# Altium project MIXR Input and Processing.PrjPcb (part 4 of 6)

## Sheet MIXR Input - Instrument Inputs.SchDoc: Instrument Inputs
size B; Organization: Midnight Sun Solar Rayce Car Team; Address1: University of Waterloo; Address2: 200 University Ave W; Address3: Waterloo, ON, Canada; Address4: N2L 3E9; DocumentNumber: 4; SheetNumber: 4; SheetTotal: 15; Website: www.uwmidsun.com; ProjectName: ProjectName
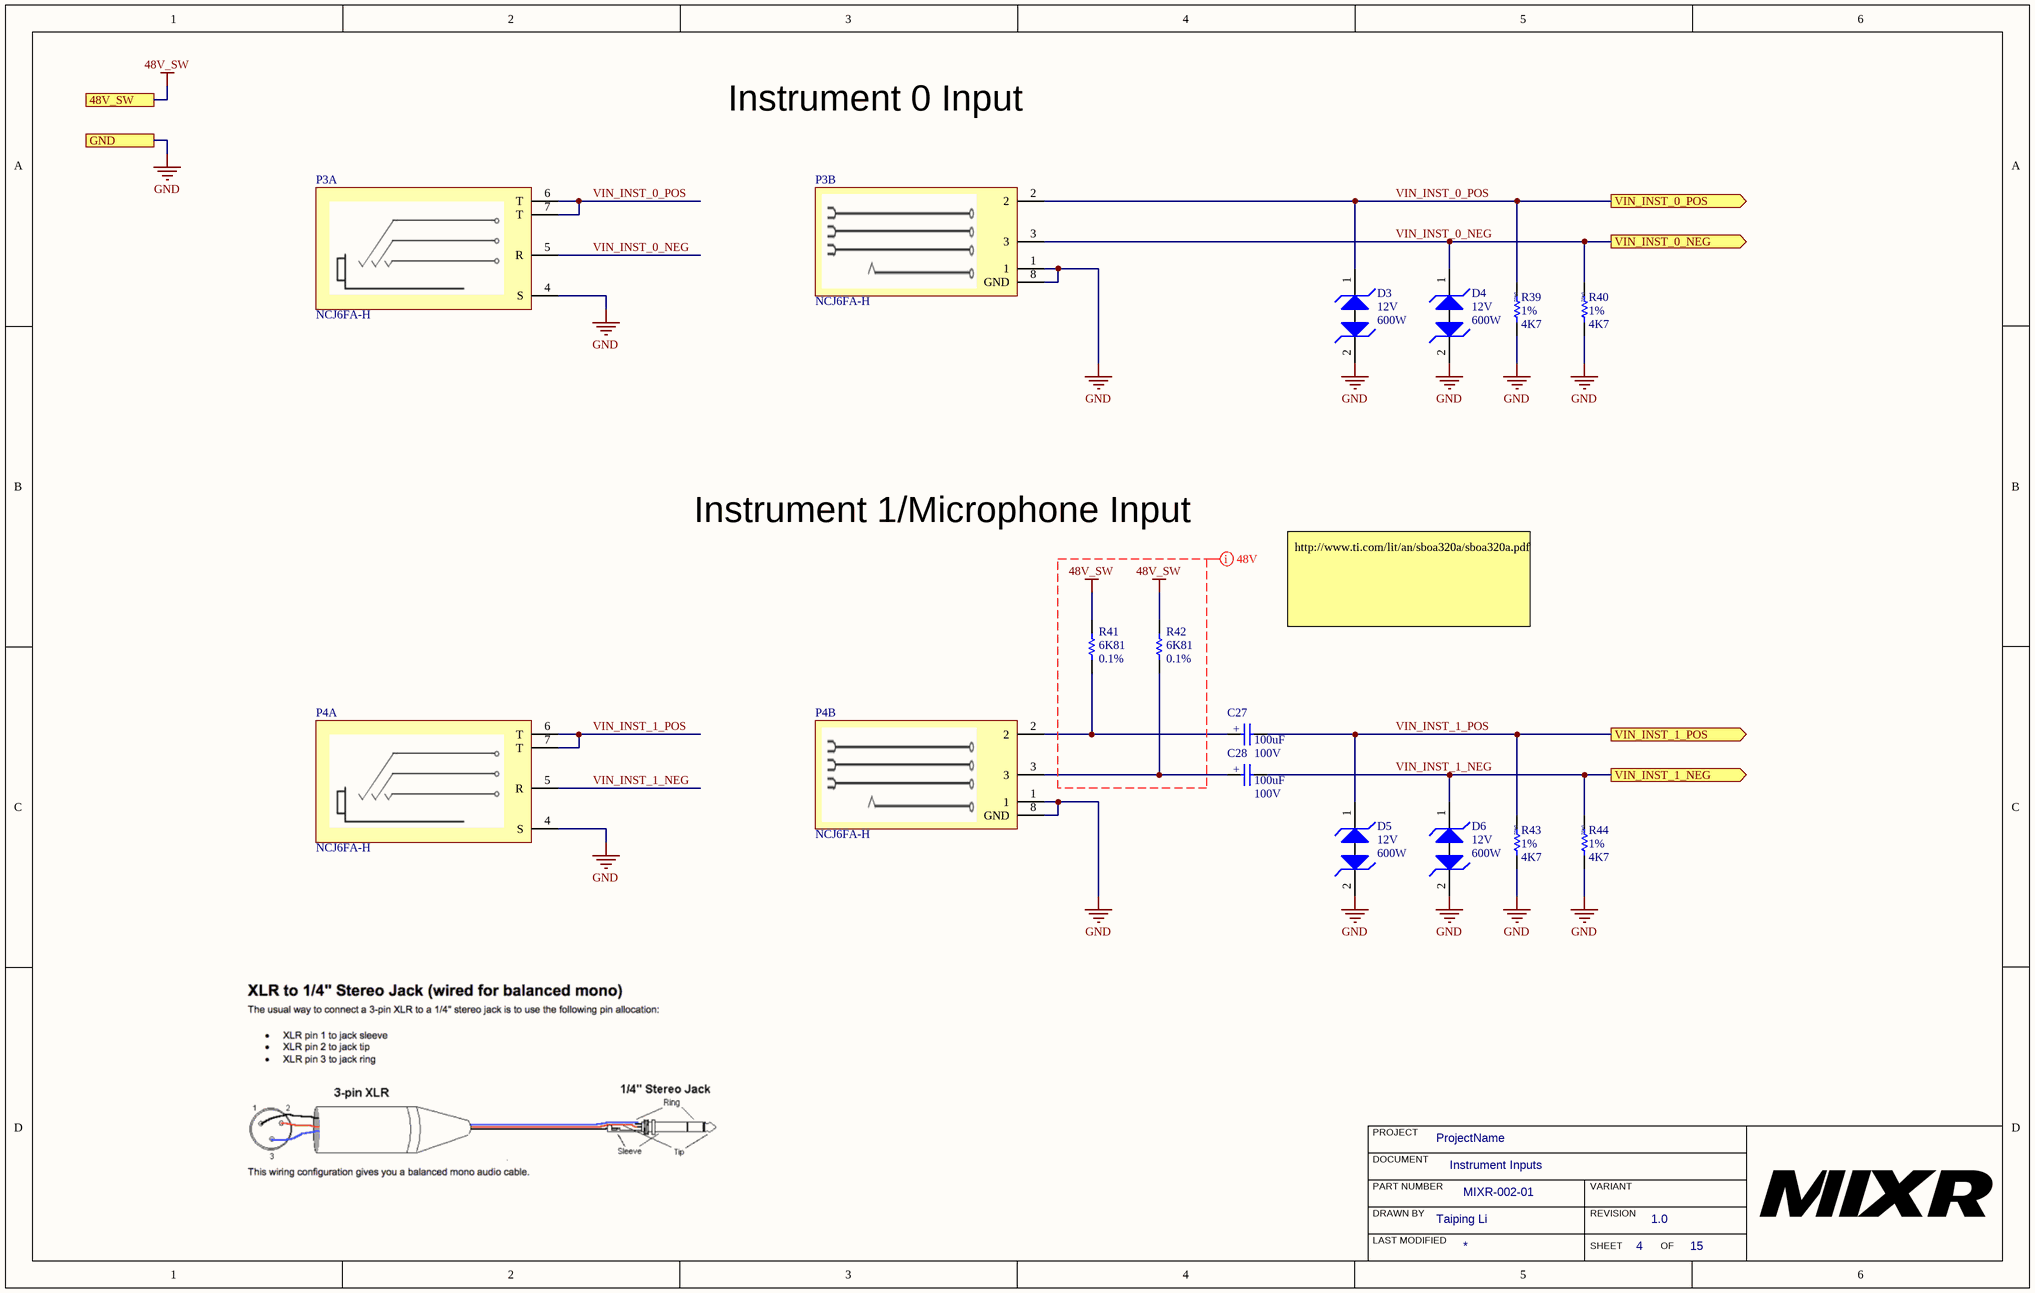
[diagram p7: MIXR Input - Instrument Inputs.SchDoc]

### Parts
C27  Capacitance: 100uF  Voltage Rating: 100V  [CAP ALUM RADIAL 10x20]  (hidden comment: CAP ALUM 100UF 20% 100V RADIAL)
C28  Capacitance: 100uF  Voltage Rating: 100V  [CAP ALUM RADIAL 10x20]  (hidden comment: CAP ALUM 100UF 20% 100V RADIAL)
D3  Voltage - Reverse Standoff (Typ): 12V  Power - Peak Pulse: 600W  [DO-214AA Diode - BI]  (hidden comment: DIODE TVS 12VWM 19.6VC DO-214AA (SMB))
D4  Voltage - Reverse Standoff (Typ): 12V  Power - Peak Pulse: 600W  [DO-214AA Diode - BI]  (hidden comment: DIODE TVS 12VWM 19.6VC DO-214AA (SMB))
D5  Voltage - Reverse Standoff (Typ): 12V  Power - Peak Pulse: 600W  [DO-214AA Diode - BI]  (hidden comment: DIODE TVS 12VWM 19.6VC DO-214AA (SMB))
D6  Voltage - Reverse Standoff (Typ): 12V  Power - Peak Pulse: 600W  [DO-214AA Diode - BI]  (hidden comment: DIODE TVS 12VWM 19.6VC DO-214AA (SMB))
P3  Manufacturer Part Number: NCJ6FA-H  [CONN XLR-TRS COMBO 3 POLE]  (hidden comment: CONN XLR-TRS COMBO 3 POLE)  (parts A,B of 2)
P4  Manufacturer Part Number: NCJ6FA-H  [CONN XLR-TRS COMBO 3 POLE]  (hidden comment: CONN XLR-TRS COMBO 3 POLE)  (parts A,B of 2)
R39  Tolerance: 1%  Resistance: 4K7  [RES 0402]  (hidden comment: RES 4.7K OHM 1% 1/10W 0402)
R40  Tolerance: 1%  Resistance: 4K7  [RES 0402]  (hidden comment: RES 4.7K OHM 1% 1/10W 0402)
R41  Tolerance: 0.1%  Resistance: 6K81  [RES, 0603]  (hidden comment: RES 6.81k OHM 0.1% 1/10W 0603)
R42  Tolerance: 0.1%  Resistance: 6K81  [RES, 0603]  (hidden comment: RES 6.81k OHM 0.1% 1/10W 0603)
R43  Tolerance: 1%  Resistance: 4K7  [RES 0402]  (hidden comment: RES 4.7K OHM 1% 1/10W 0402)
R44  Tolerance: 1%  Resistance: 4K7  [RES 0402]  (hidden comment: RES 4.7K OHM 1% 1/10W 0402)

### Ports
48V_SW, GND, VIN_INST_0_NEG (out), VIN_INST_0_POS (out), VIN_INST_1_NEG (out), VIN_INST_1_POS (out)

### Nets
48V_SW: R41.1 R42.1 ; port 48V_SW
GND: D3.2(Cathode2) D4.2(Cathode2) D5.2(Cathode2) D6.2(Cathode2) P3.1 P3.4(S) P3.8(GND) P4.1 P4.4(S) P4.8(GND) R39.2 R40.2 R43.2 R44.2 ; port GND
VIN_INST_0_NEG: D4.1(Cathode1) P3.3 P3.5(R) R40.1 ; port VIN_INST_0_NEG
VIN_INST_0_POS: D3.1(Cathode1) P3.2 P3.6(T) P3.7(T) R39.1 ; port VIN_INST_0_POS
VIN_INST_1_NEG: C28.2 D6.1(Cathode1) P4.5(R) R44.1 ; port VIN_INST_1_NEG
VIN_INST_1_POS: C27.2 D5.1(Cathode1) P4.6(T) P4.7(T) R43.1 ; port VIN_INST_1_POS
NetC27_1: C27.1 P4.2 R41.2
NetC28_1: C28.1 P4.3 R42.2

### Layout directives
mark named 48V: 48V_SW

### Notes on the sheet
- Instrument 0 Input
- Instrument 1/Microphone Input
- http://www.ti.com/lit/an/sboa320a/sboa320a.pdf
- PROJECT
- DOCUMENT
- DRAWN BY
- LAST MODIFIED
- PART NUMBER
- REVISION
- SHEET
- VARIANT
- OF
- (in symbol CAP ALUM 100UF 20% 100V RADIAL) +

### Library data of the parts
C27 C28 = CAP ALUM 100UF 20% 100V RADIAL: Manufacturer: Nichicon; Manufacturer Part Number: UFW2A101MPD1TD; Ripple Current: 350mA; Life (Hours): 2000Hour; Supplier 1: Digi-Key; RoHS: Yes; Stock 1: 465; Pricing 1: 1=0.72000, 10=0.53000, 100=0.36360 (USD); Supplier Part Number 1: 493-11050-1-ND; Category: Aluminum Electrolytic Capacitors; Mount: Through Hole; Case/Package: Radial; Min Operating Temperature: -40°C; Max Operating Temperature: 85°C; Package Quantity: 500; Packaging: Tape and Reel; Tolerance: 20%; Lead Pitch: 0.197inch; Height - Seated (Max): 0.866inch; ComponentLink1URL: https://datasheet.ciiva.com/29547/e-fw-29547515.pdf?src-supplier=Digi-Key; ComponentLink1Description: https://datasheet.ciiva.com/29547/e-fw-29547515.pdf?src-supplier=Digi-Key; ComponentLink2URL: https://datasheet.ciiva.com/29547/e-fw-29547516.pdf?src-supplier=Digi-Key; ComponentLink2Description: https://datasheet.ciiva.com/29547/e-fw-29547516.pdf?src-supplier=Digi-Key
D3-D6 = DIODE TVS 12VWM 19.6VC DO-214AA (SMB): TVS DIODE 12V 19.6V DO214AA; Manufacturer: Vishay Semiconductor Diodes Division; Manufacturer Part Number: SMBJ12CD-M3/H; Type: Zener; Voltage - Breakdown (Min): 13.5V; Current - Peak Pulse (10/1000µs): 30.6A; Power Line Protection: No; Supplier 1: Digi-Key; RoHS: RoHS Compliant; Category: Circuit Protection; Stock 1: 4469; Pricing 1: 1=0.69, 10=0.565, 25=0.516, 100=0.3841, 250=0.34808 (CAD); Packaging: Cut Tape (CT); Part Status: Active; Voltage - Clamping (Max) @ Ipp: 19.6V; Applications: General Purpose; Capacitance @ Frequency: -; Operating Temperature: -55°C ~ 150°C (TJ); Mounting Type: Surface Mount; Package / Case: DO-214AA, SMB; Supplier Device Package: DO-214AA (SMBJ); ComponentLink1URL: http://www.vishay.com/docs/87606/87606.pdf; ComponentLink1Description: http://www.vishay.com/docs/87606/87606.pdf; Supplier Part Number 1: SMBJ12CD-M3/HGICT-ND
P3 P4 = CONN XLR-TRS COMBO 3 POLE: XLR Connectors A SERIES COMBO;3POLE FEM;PCB HOR; Manufacturer_Name: Neutrik; Body Material: Metal; Gender: Female; Current Rating: 3A; Voltage Rating: 50V; Number of Positions: 3; Number of Ports: 1; Number of Contacts: 6; Connector Type: Socket; Datasheet Link: http://www.neutrik.com/zoolu-website/media/download/13540/Product+Guide+-+Section+XLR; Manufacturer_Part_Number: NCJ6FA-H; Mouser Part Number: 568-NCJ6FA-H; Mouser Price/Stock: https://www.mouser.com/Search/Refine.aspx?Keyword=568-NCJ6FA-H; Supplier 1: Mouser; Supplier Part Number 1: 568-NCJ6FA-H; Manufacturer: Neutrik; Stock 1: 3848; Pricing 1: 1 = 2.06000, 10 = 1.96000, 50 = 1.86000, 100 = 1.80000, 1000 = 1.77000, 10000 = 1.77000 (USD); RoHS: Yes; Case/Package: Metal; Number of Pins: 3; Weight: 0.388014oz; Contact Material: Bronze; Contact Plating: Gold; Number of Terminals: 6; Housing Material: Polyamide; Color: Black; Min Operating Temperature: -30°C; Max Operating Temperature: 80°C; Package Quantity: 10; Termination: Solder; Orientation: Horizontal; Length: 25mm; Depth: 30.2mm; REACH SVHC: No SVHC; Flammability Rating: UL94 HB; ComponentLink1URL: https://datasheet.ciiva.com/30126/neutrik-ncj6fa-h-1-30126129.pdf?src-supplier=Onlinecomponents.com; ComponentLink1Description: https://datasheet.ciiva.com/30126/neutrik-ncj6fa-h-1-30126129.pdf?src-supplier=Onlinecomponents.com; ComponentLink2URL: https://datasheet.ciiva.com/8008/76755-8008003.pdf?src-supplier=Element14; ComponentLink2Description: https://datasheet.ciiva.com/8008/76755-8008003.pdf?src-supplier=Element14; ComponentLink3URL: https://datasheet.ciiva.com/24394/neutrik-ncj6fa-h-1-24394955.pdf?src-supplier=Onlinecomponents.com; ComponentLink3Description: https://datasheet.ciiva.com/24394/neutrik-ncj6fa-h-1-24394955.pdf?src-supplier=Onlinecomponents.com
R39 R40 R43 R44 = RES 4.7K OHM 1% 1/10W 0402: YAGEO (PHYCOMP) - RC0402FR-074K7L - RES, THICK FILM, 4K7, 1%, 0.063W, 0402; Voltage Rating (DC): 50V; Power Rating: 62.5mW; Temperature Coefficient: 100ppm/°C; Supplier 1: Digi-Key; Manufacturer: Yageo; Manufacturer Part Number: RC0402FR-074K7L; RoHS: Yes; Category: Chip SMD Resistors; Stock 1: 11223879; Pricing 1: 1=0.10000, 10=0.01600, 100=0.00640, 1000=0.00289, 2500=0.00251, 5000=0.00207 (USD); Case/Package: 0402; Number of Pins: 2; Case Code (Imperial): 0402; Case Code (Metric): 1005; Min Operating Temperature: -55°C; Max Operating Temperature: 155°C; Voltage Rating: 50V; Packaging: Tape and Reel; Composition: Thick Film; Termination: SMD/SMT; Military Standard: Not; Length: 1mm; Height: 0.32mm; Width: 0.5mm; Depth: 0.5mm; REACH SVHC: No SVHC; Lead Free: Lead Free; ComponentLink1URL: https://datasheet.ciiva.com/7850/1018594-7850022.pdf?src-supplier=Element14; ComponentLink1Description: https://datasheet.ciiva.com/7850/1018594-7850022.pdf?src-supplier=Element14; ComponentLink2URL: https://datasheet.ciiva.com/7850/1018594-7850023.pdf?src-supplier=Element14; ComponentLink2Description: https://datasheet.ciiva.com/7850/1018594-7850023.pdf?src-supplier=Element14; ComponentLink3URL: https://datasheet.ciiva.com/15215/getdatasheetpartid-328119-15215035.pdf?src-supplier=Verical; ComponentLink3Description: https://datasheet.ciiva.com/15215/getdatasheetpartid-328119-15215035.pdf?src-supplier=Verical; ComponentLink4URL: https://datasheet.ciiva.com/22661/1686128-22661342.pdf?src-supplier=Element14; ComponentLink4Description: https://datasheet.ciiva.com/22661/1686128-22661342.pdf?src-supplier=Element14; Supplier Part Number 1: 311-4.7KLRCT-ND
R41 R42 = RES 6.81k OHM 0.1% 1/10W 0603: RES SMD 6.81K OHM 0.1% 1/5W 0603; Manufacturer: Panasonic; Manufacturer Part Number: ERJ-PB3B6811V; Max Power Dissipation: 200mW; Temperature Coefficient: 50ppm/°C; ComponentLink1URL: https://www.seielect.com/Catalog/SEI-RMCF_RMCP.pdf; ComponentLink1Description: https://www.seielect.com/Catalog/SEI-RMCF_RMCP.pdf; Supplier 1: Digi-Key; RoHS: Yes; Category: Chip SMD Resistors; Stock 1: 4623; Pricing 1: 1=0.25000, 10=0.21100, 25=0.15320, 50=0.11100, 100=0.08230, 250=0.06316, 500=0.04976, 1000=0.03445 (USD); Case/Package: 0603; Case Code (Metric): 1608; Case Code (Imperial): 0603; Min Operating Temperature: -55°C; Max Operating Temperature: 155°C; Packaging: Tape and Reel; Composition: Thick Film; Number of Terminations: 2; Features: Automotive AEC-Q200; Length: 0.063inch; Width: 0.032inch; Height - Seated (Max): 0.022inch; ComponentLink2URL: https://industrial.panasonic.com/sa/system/files/data/download/catalog/id_fixed-resistors_e_2.pdf?src-supplier=Digi-Key; ComponentLink2Description: https://industrial.panasonic.com/sa/system/files/data/download/catalog/id_fixed-resistors_e_2.pdf?src-supplier=Digi-Key; Supplier Part Number 1: P20068CT-ND

## Sheet MIXR Input - Instrument 1 Filtering & ADC.SchDoc: Instrument 1/Microphone Filtering & ADC
size B; Organization: Midnight Sun Solar Rayce Car Team; Address1: University of Waterloo; Address2: 200 University Ave W; Address3: Waterloo, ON, Canada; Address4: N2L 3E9; DocumentNumber: 6; SheetNumber: 6; SheetTotal: 15; Website: www.uwmidsun.com; ProjectName: ProjectName
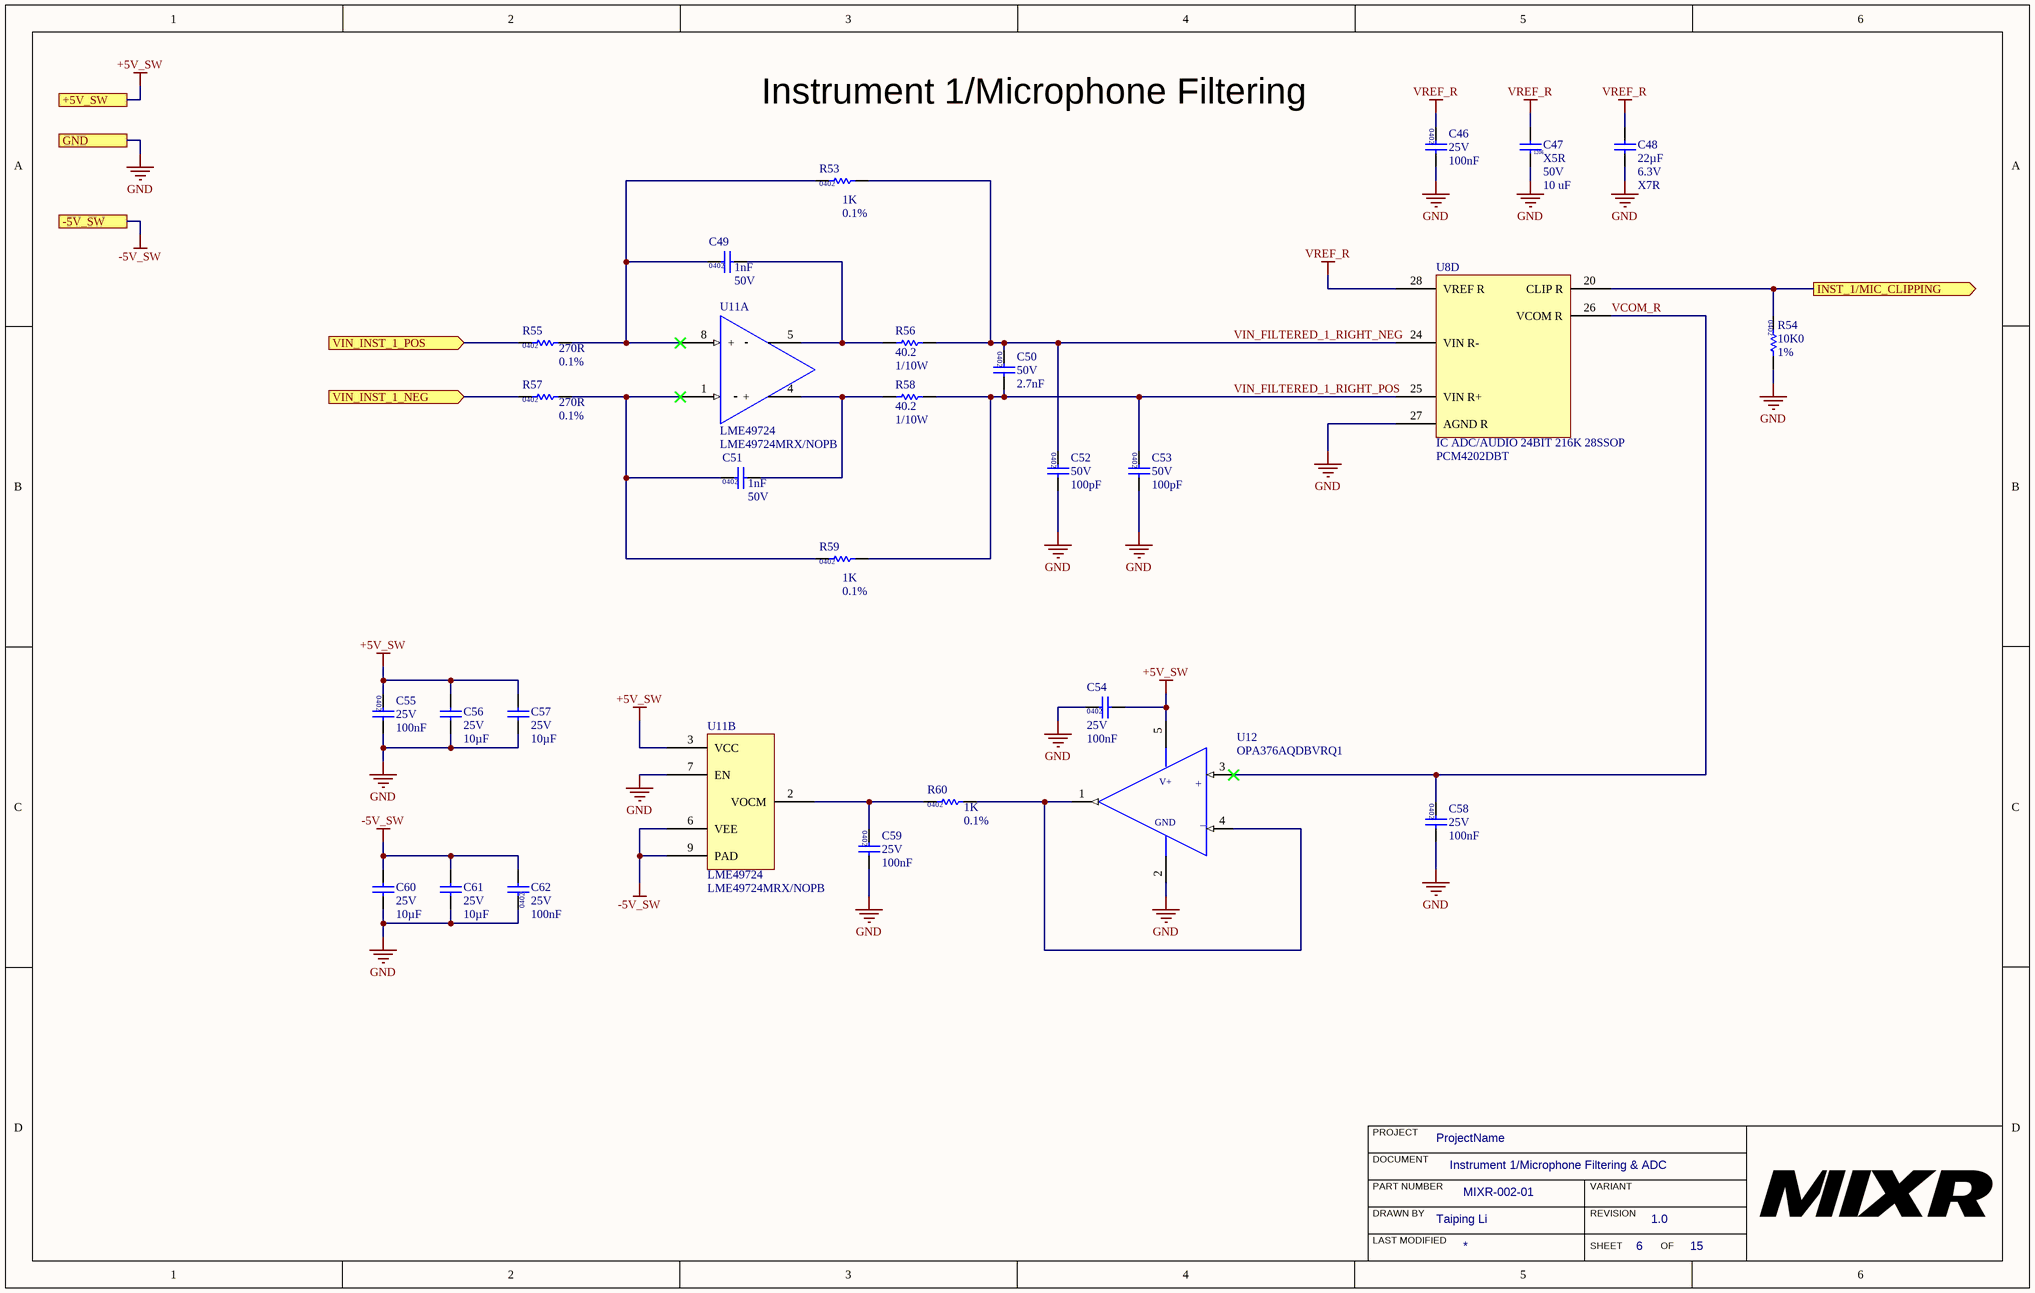
[diagram p8: MIXR Input - Instrument 1 Filtering & ADC.SchDoc]

### Parts
C46  Voltage: 25V  Capacitance: 100nF  [CAP 0402]  (hidden comment: CAP CER 0.1UF 16V X7R 0402)
C47  Rating: X5R  Voltage Rating: 50V  Capacitance: 10 uF  [CAP, 1206]  (hidden comment: CAP CER 10uF 50V 20% X5R 1206)
C48  Capacitance: 22µF  Voltage: 6.3V  Temperature Coefficient: X7R  [CAP, 1206]  (hidden comment: CAP CER 22UF 6.3V ±10% X7R 1206)
C49  Voltage Rating: 50V  Capacitance: 1nF  [CAP 0402]  (hidden comment: CAP CER 1nF 50V C0G 0402)
C50  Voltage Rating: 50V  Capacitance: 2.7nF  [CAP 0402]  (hidden comment: CAP CER 2700PF 50V X7R 0402)
C51  Voltage Rating: 50V  Capacitance: 1nF  [CAP 0402]  (hidden comment: CAP CER 1nF 50V C0G 0402)
C52  Voltage Rating: 50V  Capacitance: 100pF  [CAP 0402]  (hidden comment: CAP CER 100PF 50V C0G/NP0 0402)
C53  Voltage Rating: 50V  Capacitance: 100pF  [CAP 0402]  (hidden comment: CAP CER 100PF 50V C0G/NP0 0402)
C54  Voltage: 25V  Capacitance: 100nF  [CAP 0402]  (hidden comment: CAP CER 0.1UF 16V X7R 0402)
C55  Voltage: 25V  Capacitance: 100nF  [CAP 0402]  (hidden comment: CAP CER 0.1UF 16V X7R 0402)
C56  Voltage - Rated: 25V  Capacitance: 10µF  [CAP, 0805]  (hidden comment: CAP CER 10uF 25V 10% X5R 0805)
C57  Voltage - Rated: 25V  Capacitance: 10µF  [CAP, 0805]  (hidden comment: CAP CER 10uF 25V 10% X5R 0805)
C58  Voltage: 25V  Capacitance: 100nF  [CAP 0402]  (hidden comment: CAP CER 0.1UF 16V X7R 0402)
C59  Voltage: 25V  Capacitance: 100nF  [CAP 0402]  (hidden comment: CAP CER 0.1UF 16V X7R 0402)
C60  Voltage - Rated: 25V  Capacitance: 10µF  [CAP, 0805]  (hidden comment: CAP CER 10uF 25V 10% X5R 0805)
C61  Voltage - Rated: 25V  Capacitance: 10µF  [CAP, 0805]  (hidden comment: CAP CER 10uF 25V 10% X5R 0805)
C62  Voltage: 25V  Capacitance: 100nF  [CAP 0402]  (hidden comment: CAP CER 0.1UF 16V X7R 0402)
R53  Tolerance: 0.1%  Resistance: 1K  [RES 0402]  (hidden comment: RES 1K OHM 0.1% 1/16W 0402)
R54  Resistance: 10K0  Tolerance: 1%  [RES 0402]  (hidden comment: RES 10K OHM 1% 1/16W 0402)
R55  Tolerance: 0.1%  Resistance: 270R  [RES 0402]  (hidden comment: RES 270 OHM 0.1% 1/16W 0402)
R56  Resistance: 40.2  Power: 1/10W  [RES, 0603]  (hidden comment: RES 40.2 OHM 0.5% 1/10W 0603)
R57  Tolerance: 0.1%  Resistance: 270R  [RES 0402]  (hidden comment: RES 270 OHM 0.1% 1/16W 0402)
R58  Resistance: 40.2  Power: 1/10W  [RES, 0603]  (hidden comment: RES 40.2 OHM 0.5% 1/10W 0603)
R59  Tolerance: 0.1%  Resistance: 1K  [RES 0402]  (hidden comment: RES 1K OHM 0.1% 1/16W 0402)
R60  Tolerance: 0.1%  Resistance: 1K  [RES 0402]  (hidden comment: RES 1K OHM 0.1% 1/16W 0402)
U8  IC ADC/AUDIO 24BIT 216K 28SSOP  Manufacturer Part Number: PCM4202DBT  [IC ADC 24 BIT AUDIO 216 KHZ SSOP-28]  (part D of 4)
U11  LME49724  Manufacturer Part Number: LME49724MRX/NOPB  [IC OP AMP AUDIO LME49724 8-SOIC]  (parts A,B of 2)
U12  Manufacturer Part Number: OPA376AQDBVRQ1  [IC OP AMP GP RR 10MHZ SOT-23-5]  (hidden comment: IC OP AMP GEN PURPOSE RR 5.5MHZ SOT-23-5)

### Ports
+5V_SW, -5V_SW, GND, INST_1/MIC_CLIPPING (out), VIN_INST_1_NEG (in), VIN_INST_1_POS (in)

### Nets
+5V_SW: C54.2 C55.1 C56.1 C57.1 U11.3(VCC) U12.5(VDD) ; port +5V_SW
-5V_SW: C60.2 C61.2 C62.2 U11.6(VEE) U11.9(PAD) ; port -5V_SW
GND: C46.2 C47.2 C48.2 C52.2 C53.2 C54.1 C55.2 C56.2 C57.2 C58.2 C59.2 C60.1 C61.1 C62.1 R54.2 U8.27(AGND_R) U11.7(EN) U12.2(VSS) ; port GND
VREF_R: C46.1 C47.1 C48.1 U8.28(VREF_R)
INST_1/MIC_CLIPPING: R54.1 U8.20(CLIP_R) ; port INST_1/MIC_CLIPPING
VCOM_R: C58.1 U8.26(VCOM_R) U12.3(+IN)
VIN_FILTERED_1_RIGHT_NEG: C50.1 C52.1 R53.2 R56.2 U8.24(VIN_R-)
VIN_FILTERED_1_RIGHT_POS: C50.2 C53.1 R58.2 R59.2 U8.25(VIN_R+)
VIN_INST_1_NEG: R57.1 ; port VIN_INST_1_NEG
VIN_INST_1_POS: R55.1 ; port VIN_INST_1_POS
NetC49_1: C49.1 R53.1 R55.2 U11.8(+)
NetC49_2: C49.2 R56.1 U11.5(-)
NetC51_1: C51.1 R57.2 R59.1 U11.1(-)
NetC51_2: C51.2 R58.1 U11.4(+)
NetC59_1: C59.1 R60.1 U11.2(VOCM)
NetR60_2: R60.2 U12.1(OUTPUT) U12.4(-IN)

### Notes on the sheet
- Instrument 1/Microphone Filtering
- PROJECT
- DOCUMENT
- DRAWN BY
- LAST MODIFIED
- PART NUMBER
- REVISION
- SHEET
- VARIANT
- OF
- (in symbol IC OP AMP GEN PURPOSE RR 5.5MHZ SOT-23-5) V+; +; GND; _

### Library data of the parts
C46 C54 C55 C58 C59 C62 = CAP CER 0.1UF 16V X7R 0402: as C2-C7 on sheet MIXR Processing - ESP32; Supplier 1: Digi-Key; RoHS: Yes; Category: Ceramic Capacitors; Stock 1: 785540; Pricing 1: 1=0.10000, 10=0.03400, 100=0.01520, 500=0.01088, 1000=0.00855, 2500=0.00778, 5000=0.00715 (USD); Mount: Surface Mount; Case/Package: 0402; Weight: 0.000212oz; Case Code (Metric): 1005; Case Code (Imperial): 0402; Dielectric Material: Ceramic; Min Operating Temperature: -55°C; Max Operating Temperature: 125°C; Packaging: Tape and Reel; Tolerance: 10%; Termination: SMD/SMT; Composition: Ceramic; Package Quantity: 10000; Length: 1mm; Height: 0.5mm; Width: 0.02inch; Thickness: 0.022inch; Depth: 0.5mm; REACH SVHC: Unknown; Lead Free: Lead Free; ComponentLink1URL: http://www.farnell.com/datasheets/2048008.pdf?src-supplier=Farnell; ComponentLink1Description: http://www.farnell.com/datasheets/2048008.pdf?src-supplier=Farnell; ComponentLink2URL: http://uk.rs-online.com/webdocs/144c/0900766b8144c113.pdf?src-supplier=RSComponents; ComponentLink2Description: http://uk.rs-online.com/webdocs/144c/0900766b8144c113.pdf?src-supplier=RSComponents; ComponentLink3URL: http://www.farnell.com/datasheets/1872206.pdf?src-supplier=Farnell; ComponentLink3Description: http://www.farnell.com/datasheets/1872206.pdf?src-supplier=Farnell; ComponentLink4URL: http://components.arrow.com/part/dataview/0323_06361249?src-supplier=Arrow+Europe; ComponentLink4Description: http://components.arrow.com/part/dataview/0323_06361249?src-supplier=Arrow+Europe; ComponentLink5URL: http://www.mouser.com/ds/2/281/c02e-2905.pdf?src-supplier=Mouser; ComponentLink5Description: http://www.mouser.com/ds/2/281/c02e-2905.pdf?src-supplier=Mouser; ComponentLink6URL: http://www.farnell.com/datasheets/2048008.pdf?src-supplier=Newark; ComponentLink6Description: http://www.farnell.com/datasheets/2048008.pdf?src-supplier=Newark; ComponentLink7URL: http://psearch.en.murata.com/capacitor/product/GRM155R71E104KE14%23.pdf?src-supplier=Avnet; ComponentLink7Description: http://psearch.en.murata.com/capacitor/product/GRM155R71E104KE14%23.pdf?src-supplier=Avnet; ComponentLink8URL: https://search.murata.co.jp/Ceramy/image/img/A01X/G101/ENG/GRM155R71E104KE14-01.pdf?src-supplier=Digi-Key; ComponentLink8Description: https://search.murata.co.jp/Ceramy/image/img/A01X/G101/ENG/GRM155R71E104KE14-01.pdf?src-supplier=Digi-Key; ComponentLink9URL: http://www.farnell.com/datasheets/2048008.pdf?src-supplier=Element14; ComponentLink9Description: http://www.farnell.com/datasheets/2048008.pdf?src-supplier=Element14; Supplier Part Number 1: 490-10698-1-ND; Dielectric: X7R; Voltage Rating (DC): 25V; Voltage Rating: 25V
C47 = CAP CER 10uF 50V 20% X5R 1206: 10µF ±20% 50V Ceramic Capacitor X5R 1206 (3216 Metric) /; Manufacturer: Murata; Manufacturer Part Number: GRT31CR61H106ME01L; Supplier 1: Digi-Key; Supplier Part Number 1: 490-12457-1-ND; RoHS: Yes; Stock 1: 449467; Pricing 1: 1 = 0.57000, 10 = 0.39800, 100 = 0.23910, 500 = 0.17930, 1000 = 0.15141 (USD); Mount: Surface Mount; Case/Package: 1206; Case Code (Metric): 3216; Case Code (Imperial): 1206; Min Operating Temperature: -55°C; Max Operating Temperature: 85°C; Packaging: Tape and Reel; Tolerance: 20%; Length: 0.126inch; Width: 0.063inch; Thickness: 0.071inch; Ratings: AEC-Q200
C48 = CAP CER 22UF 6.3V ±10% X7R 1206: 22µF ±10% 6.3V Ceramic Capacitor X7R 1206 (3216 Metric); Manufacturer 1: Murata Electronics North America; Manufacturer Part Number 1: GRM31CR70J226KE19L; Supplier 1: Digi-Key; Supplier Part Number 1: 490-6515-1-ND; Packaging: Cut Tape (CT); Part Status: Active; Operating Temperature: -55°C ~ 125°C; Ratings: -; Mounting Type: Surface Mount, MLCC; Package / Case: 1206 (3216 Metric); Size / Dimension: 0.126" L x 0.063" W (3.20mm x 1.60mm); Height - Seated (Max): -; Thickness (Max): 0.071" (1.80mm); Lead Spacing: -; Lead Style: -; ComponentLink1URL: http://www.murata.com/~/media/webrenewal/support/library/catalog/products/capacitor/mlcc/c02e.ashx; ComponentLink1Description: http://www.murata.com/~/media/webrenewal/support/library/catalog/products/capacitor/mlcc/c02e.ashx; Tolerance: ±10%
C49 C51 = CAP CER 1nF 50V C0G 0402: CAP CER 1000PF 50V C0G/NP0 0402; Manufacturer: Murata; Manufacturer Part Number: GRM1555C1H102JA01D; Material: Ceramic; Tolerance: 5%; Insulation Resistance: 10GR; Temperature Coefficient: 30ppm/°C; Supplier 1: Digi-Key; RoHS: Yes; Category: Ceramic Capacitors; Stock 1: 4453187; Pricing 1: 1=0.11000, 10=0.07900, 100=0.03700, 500=0.02596, 1000=0.02149, 2500=0.02000, 5000=0.01830 (USD); Mount: Surface Mount; Case/Package: 0402; Number of Pins: 2; Case Code (Metric): 1005; Case Code (Imperial): 0402; Dielectric Material: Ceramic; Min Operating Temperature: -55°C; Max Operating Temperature: 125°C; Package Quantity: 1; Packaging: Tape and Reel; Voltage Rating (DC): 50V; Dielectric: C0G; Termination: SMD/SMT; Voltage: 50V; Length: 1mm; Height: 0.5mm; Width: 0.5mm; Thickness: 0.022inch; Depth: 0.5mm; Radiation Hardening: No; REACH SVHC: No SVHC; Lead Free: Lead Free; ComponentLink1URL: https://datasheet.ciiva.com/132/product-132800.pdf?src-supplier=Digi-Key; ComponentLink1Description: https://datasheet.ciiva.com/132/product-132800.pdf?src-supplier=Digi-Key; ComponentLink2URL: https://datasheet.ciiva.com/34302/1855908-34302849.pdf?src-supplier=Jameco; ComponentLink2Description: https://datasheet.ciiva.com/34302/1855908-34302849.pdf?src-supplier=Jameco; ComponentLink3URL: https://datasheet.ciiva.com/18184/getdatasheetpartid-90260-18184180.pdf?src-supplier=Verical; ComponentLink3Description: https://datasheet.ciiva.com/18184/getdatasheetpartid-90260-18184180.pdf?src-supplier=Verical; ComponentLink4URL: https://datasheet.ciiva.com/11786/0900766b807a1cab-11786727.pdf?src-supplier=RSComponents; ComponentLink4Description: https://datasheet.ciiva.com/11786/0900766b807a1cab-11786727.pdf?src-supplier=RSComponents; ComponentLink5URL: https://datasheet.ciiva.com/29200/453569-da-01-en-vs-kondensator-0402-29200121.pdf?src-supplier=Conrad; ComponentLink5Description: https://datasheet.ciiva.com/29200/453569-da-01-en-vs-kondensator-0402-29200121.pdf?src-supplier=Conrad; ComponentLink6URL: https://datasheet.ciiva.com/132/grm1555c1h102ja01-01-132801.pdf?src-supplier=Digi-Key; ComponentLink6Description: https://datasheet.ciiva.com/132/grm1555c1h102ja01-01-132801.pdf?src-supplier=Digi-Key; ComponentLink7URL: https://datasheet.ciiva.com/7828/4360-7828821.pdf?src-supplier=Element14; ComponentLink7Description: https://datasheet.ciiva.com/7828/4360-7828821.pdf?src-supplier=Element14; ComponentLink8URL: https://datasheet.ciiva.com/7828/1747436-7828822.pdf?src-supplier=Element14; ComponentLink8Description: https://datasheet.ciiva.com/7828/1747436-7828822.pdf?src-supplier=Element14; ComponentLink9URL: https://datasheet.ciiva.com/14116/grmseries-tc-hitype-eng-14116919.pdf?src-supplier=Distrelec; ComponentLink9Description: https://datasheet.ciiva.com/14116/grmseries-tc-hitype-eng-14116919.pdf?src-supplier=Distrelec; ComponentLink10URL: https://datasheet.ciiva.com/14116/grmseries-tc-hitype-eng-14116858.pdf?src-supplier=Distrelec; ComponentLink10Description: https://datasheet.ciiva.com/14116/grmseries-tc-hitype-eng-14116858.pdf?src-supplier=Distrelec; Supplier Part Number 1: 490-3244-1-ND
C50 = CAP CER 2700PF 50V X7R 0402: Manufacturer: Yageo; Manufacturer Part Number: CC0402KRX7R9BB272; Tolerance: 10%; ComponentLink1URL: https://datasheet.ciiva.com/26889/getdatasheetpartid-748988-26889122.pdf?src-supplier=Verical; ComponentLink1Description: https://datasheet.ciiva.com/26889/getdatasheetpartid-748988-26889122.pdf?src-supplier=Verical; Supplier 1: Digi-Key; RoHS: Yes; Category: Ceramic Capacitors; Stock 1: 768152; Pricing 1: 1=0.10000, 10=0.02700, 100=0.01210, 500=0.00864, 1000=0.00679, 2500=0.00618, 5000=0.00568 (USD); Mount: Surface Mount; Case/Package: 0402; Number of Pins: 2; Case Code (Metric): 1005; Case Code (Imperial): 0402; Min Operating Temperature: -55°C; Max Operating Temperature: 125°C; Package Quantity: 1; Packaging: Tape and Reel; Dielectric: X7R; Termination: SMD/SMT; Voltage Rating (DC): 50V; Length: 1mm; Width: 0.02inch; Thickness: 0.022inch; Depth: 0.5mm; Radiation Hardening: No; Lead Free: Lead Free; Halogen Free: Halogen Free; ComponentLink2URL: https://datasheet.ciiva.com/143/mlccorderingcode-143983.pdf?src-supplier=Digi-Key; ComponentLink2Description: https://datasheet.ciiva.com/143/mlccorderingcode-143983.pdf?src-supplier=Digi-Key; ComponentLink3URL: https://datasheet.ciiva.com/143/mlccorderingcode-143984.pdf?src-supplier=Digi-Key; ComponentLink3Description: https://datasheet.ciiva.com/143/mlccorderingcode-143984.pdf?src-supplier=Digi-Key; ComponentLink4URL: https://datasheet.ciiva.com/143/mlccorderingcode-143985.pdf?src-supplier=Digi-Key; ComponentLink4Description: https://datasheet.ciiva.com/143/mlccorderingcode-143985.pdf?src-supplier=Digi-Key; ComponentLink5URL: https://datasheet.ciiva.com/13174/upy-gphc-x7r-6-3v-to-50v-8-12304-13174619.pdf?src-supplier=Mouser; ComponentLink5Description: https://datasheet.ciiva.com/13174/upy-gphc-x7r-6-3v-to-50v-8-12304-13174619.pdf?src-supplier=Mouser; ComponentLink6URL: https://datasheet.ciiva.com/15189/getdatasheetpartid-314499-15189132.pdf?src-supplier=Verical; ComponentLink6Description: https://datasheet.ciiva.com/15189/getdatasheetpartid-314499-15189132.pdf?src-supplier=Verical; Supplier Part Number 1: 311-1033-1-ND
C52 C53 = CAP CER 100PF 50V C0G/NP0 0402: 100pF ±5% 50V Ceramic Capacitor C0G, NP0 0402 (1005 Metric) /; Manufacturer: Murata; Manufacturer Part Number: GCM1555C1H101JA16D; Supplier 1: Digi-Key; RoHS: Yes; Category: Ceramic Capacitors; Stock 1: 1814758; Pricing 1: 1=0.10000, 10=0.05900, 100=0.02640, 500=0.01884, 1000=0.01480, 2500=0.01345, 5000=0.01237 (USD); Mount: Surface Mount; Case/Package: 0402; Weight: 0.000212oz; Case Code (Metric): 1005; Case Code (Imperial): 0402; Min Operating Temperature: -55°C; Max Operating Temperature: 125°C; Tolerance: 5%; Packaging: Tape and Reel; Dielectric: C0G; Voltage: 50V; Termination: SMD/SMT; Voltage Rating (DC): 50V; Package Quantity: 10000; Length: 1mm; Height: 0.5mm; Width: 0.02inch; Thickness: 0.022inch; Depth: 0.5mm; Ratings: AEC-Q200; Radiation Hardening: No; REACH SVHC: No SVHC; Lead Free: Lead Free; ComponentLink1URL: https://datasheet.ciiva.com/26889/getdatasheetpartid-748988-26889122.pdf?src-supplier=Verical; ComponentLink1Description: https://datasheet.ciiva.com/26889/getdatasheetpartid-748988-26889122.pdf?src-supplier=Verical; Supplier Part Number 1: 490-10669-1-ND
C56 C57 C60 C61 = CAP CER 10uF 25V 10% X5R 0805: 10µF ±10% 25V Ceramic Capacitor X5R 0805 (2012 Metric); Manufacturer: Murata Electronics North America; Manufacturer Part Number: GRM21BR61E106KA73L; Supplier 1: Digi-Key; RoHS: RoHS Compliant; Category: Capacitors; Stock 1: 1695157; Packaging: Cut Tape (CT); Part Status: Active; Tolerance: ±10%; Temperature Coefficient: X5R; Operating Temperature: -55°C ~ 85°C; Features: -; Ratings: -; Applications: General Purpose; Mounting Type: Surface Mount, MLCC; Package / Case: 0805 (2012 Metric); Size / Dimension: 0.079" L x 0.049" W (2.00mm x 1.25mm); Height - Seated (Max): -; Thickness (Max): 0.053" (1.35mm); Lead Spacing: -; Lead Style: -; ComponentLink1URL: http://search.murata.co.jp/Ceramy/image/img/A01X/G101/ENG/GRM21BR61E106KA73-01.pdf; ComponentLink1Description: http://search.murata.co.jp/Ceramy/image/img/A01X/G101/ENG/GRM21BR61E106KA73-01.pdf; Supplier Part Number 1: 490-5523-1-ND; Pricing 1: 1=0.3, 10=0.214, 100=0.1008, 500=0.07068, 1000=0.05851 (CAD)
R53 R59 = RES 1K OHM 0.1% 1/16W 0402: RES SMD 1K OHM 0.1% 1/16W 0402; Manufacturer: Yageo; Manufacturer Part Number: RT0402BRE071KL; Power Rating: 62.5mW; Voltage Rating: 50V; Temperature Coefficient: 50ppm/°C; Max Power Dissipation: 63mW; Supplier 1: Digi-Key; RoHS: Yes; Category: Chip SMD Resistors; Stock 1: 46127; Pricing 1: 1=0.41000, 10=0.29200, 100=0.11690, 1000=0.05758, 2500=0.05335, 5000=0.04827 (USD); Case/Package: 0402; Weight: 2.3E-05oz; Case Code (Imperial): 0402; Case Code (Metric): 1005; Min Operating Temperature: -55°C; Max Operating Temperature: 125°C; Packaging: Tape and Reel; Package Quantity: 10000; Composition: Thin Film; Termination: SMD/SMT; Number of Terminations: 2; Military Standard: Not; Voltage Rating (DC): 50V; Features: Moisture Resistant; Length: 1mm; Height: 0.014inch; Width: 0.02inch; Depth: 0.5mm; Lead Free: Lead Free; ComponentLink1URL: https://datasheet.ciiva.com/2582/pyu-rt-1-to-0-05-rohs-l-5-2582672.pdf?src-supplier=Digi-Key; ComponentLink1Description: https://datasheet.ciiva.com/2582/pyu-rt-1-to-0-05-rohs-l-5-2582672.pdf?src-supplier=Digi-Key; ComponentLink2URL: https://datasheet.ciiva.com/12796/pyu-rt-1-to-0-05-rohs-l-4-12796476.pdf?src-supplier=Mouser; ComponentLink2Description: https://datasheet.ciiva.com/12796/pyu-rt-1-to-0-05-rohs-l-4-12796476.pdf?src-supplier=Mouser; Supplier Part Number 1: YAG2306CT-ND
R54 = RES 10K OHM 1% 1/16W 0402: Surface Mount Thick Film Resistor, Rc Series, 10 Kohm, 62.5 Mw, - 1%, 50 V, 0402 [1005 Metric]; Manufacturer: Yageo; Manufacturer Part Number: RC0402FR-0710KL; Temperature Coefficient: 100ppm/°C; Voltage Rating: 50V; Power Rating: 62.5mW; Supplier 1: Digi-Key; RoHS: Yes; Category: Chip SMD Resistors; Stock 1: 60761136; Pricing 1: 1=0.10000, 10=0.01600, 100=0.00640, 1000=0.00289, 2500=0.00251, 5000=0.00207 (USD); Case/Package: 0402; Number of Pins: 2; Case Code (Imperial): 0402; Case Code (Metric): 1005; Min Operating Temperature: -55°C; Max Operating Temperature: 155°C; Packaging: Tape and Reel; Composition: Thick Film; Voltage Rating (DC): 50V; Termination: SMD/SMT; Military Standard: Not; Working Voltage: 50V; Number of Terminations: 2; Length: 1mm; Height: 0.32mm; Width: 0.5mm; Depth: 0.5mm; Lead Pitch: 0.2mm; REACH SVHC: No SVHC; Lead Free: Lead Free; ComponentLink1URL: https://datasheet.ciiva.com/7660/38568-7660787.pdf?src-supplier=Element14; ComponentLink1Description: https://datasheet.ciiva.com/7660/38568-7660787.pdf?src-supplier=Element14; ComponentLink2URL: https://datasheet.ciiva.com/7983/1018594-7983486.pdf?src-supplier=Element14; ComponentLink2Description: https://datasheet.ciiva.com/7983/1018594-7983486.pdf?src-supplier=Element14; ComponentLink3URL: https://datasheet.ciiva.com/7849/1784430-7849813.pdf?src-supplier=Element14; ComponentLink3Description: https://datasheet.ciiva.com/7849/1784430-7849813.pdf?src-supplier=Element14; ComponentLink4URL: https://datasheet.ciiva.com/7849/1686128-7849814.pdf?src-supplier=Element14; ComponentLink4Description: https://datasheet.ciiva.com/7849/1686128-7849814.pdf?src-supplier=Element14; ComponentLink5URL: https://datasheet.ciiva.com/7849/1784430-7849815.pdf?src-supplier=Element14; ComponentLink5Description: https://datasheet.ciiva.com/7849/1784430-7849815.pdf?src-supplier=Element14; ComponentLink6URL: https://datasheet.ciiva.com/22747/1018594-22747512.pdf?src-supplier=Element14; ComponentLink6Description: https://datasheet.ciiva.com/22747/1018594-22747512.pdf?src-supplier=Element14; ComponentLink7URL: https://datasheet.ciiva.com/12667/pyu-rc0402-51-rohs-l-6-r-12667067.pdf?src-supplier=Mouser; ComponentLink7Description: https://datasheet.ciiva.com/12667/pyu-rc0402-51-rohs-l-6-r-12667067.pdf?src-supplier=Mouser; Supplier Part Number 1: 311-10.0KLRCT-ND
R55 R57 = RES 270 OHM 0.1% 1/16W 0402: RES SMD 270 OHM 0.1% 1/16W 0402; Manufacturer: Yageo; Manufacturer Part Number: RT0402BRD07270RL; Power Rating: 62.5mW; Voltage Rating: 50V; Max Power Dissipation: 63mW; Temperature Coefficient: 25ppm/°C; Supplier 1: Digi-Key; RoHS: Yes; Category: Chip SMD Resistors; Stock 1: 11367; Pricing 1: 1=0.41000, 10=0.29200, 100=0.11690, 1000=0.05762, 2500=0.05338, 5000=0.04830 (USD); Case/Package: 0402; Weight: 2.3E-05oz; Case Code (Metric): 1005; Case Code (Imperial): 0402; Min Operating Temperature: -55°C; Max Operating Temperature: 125°C; Package Quantity: 10000; Packaging: Tape and Reel; Composition: Thin Film; Number of Terminations: 2; Termination: SMD/SMT; Military Standard: Not; Voltage Rating (DC): 50V; Features: Moisture Resistant; Length: 1mm; Height: 0.014inch; Width: 0.5mm; Depth: 0.5mm; Lead Free: Lead Free; ComponentLink1URL: https://datasheet.ciiva.com/12799/pyu-rt-1-to-0-05-rohs-l-4-12799141.pdf?src-supplier=Mouser; ComponentLink1Description: https://datasheet.ciiva.com/12799/pyu-rt-1-to-0-05-rohs-l-4-12799141.pdf?src-supplier=Mouser; ComponentLink2URL: https://datasheet.ciiva.com/2582/pyu-rt-1-to-0-05-rohs-l-4-2582265.pdf?src-supplier=Digi-Key; ComponentLink2Description: https://datasheet.ciiva.com/2582/pyu-rt-1-to-0-05-rohs-l-4-2582265.pdf?src-supplier=Digi-Key; Supplier Part Number 1: YAG1396CT-ND; ComponentLink3URL: https://datasheet.ciiva.com/46635/pyu-rt-1-to-0-05-rohs-l-5-46635177.pdf?src-supplier=Digi-Key; ComponentLink3Description: https://datasheet.ciiva.com/46635/pyu-rt-1-to-0-05-rohs-l-5-46635177.pdf?src-supplier=Digi-Key
R56 R58 = RES 40.2 OHM 0.5% 1/10W 0603: RES SMD 40.2 OHM 0.5% 1/10W 0603; Manufacturer 1: Yageo; Manufacturer Part Number 1: RT0603DRE0740R2L; Temperature Coefficient: ±50ppm/°C; Supplier 1: Digi-Key; Supplier Part Number 1: 311-2576-1-ND; Packaging: Cut Tape (CT); Part Status: Active; Composition: Thin Film; Operating Temperature: -55°C ~ 155°C; Package / Case: 0603 (1608 Metric); Supplier Device Package: 0603; Size / Dimension: 0.063" L x 0.031" W (1.60mm x 0.80mm); Height - Seated (Max): 0.022" (0.55mm); Failure Rate: -; ComponentLink1URL: http://www.yageo.com/documents/recent/PYu-RT_1-to-0.01_RoHS_L_7.pdf; ComponentLink1Description: http://www.yageo.com/documents/recent/PYu-RT_1-to-0.01_RoHS_L_7.pdf; Tolerance: ±0.5%
R60 = RES 1K OHM 0.1% 1/16W 0402: RES SMD 1K OHM 0.1% 1/16W 0402; Manufacturer: Yageo; Manufacturer Part Number: RT0402BRE071KL; Power Rating: 62.5mW; Voltage Rating: 50V; Max Power Dissipation: 63mW; Temperature Coefficient: 50ppm/°C; Supplier 1: Digi-Key; RoHS: Yes; Category: Chip SMD Resistors; Stock 1: 46127; Pricing 1: 1=0.41000, 10=0.29200, 100=0.11690, 1000=0.05758, 2500=0.05335, 5000=0.04827 (USD); Case/Package: 0402; Weight: 2.3E-05oz; Case Code (Metric): 1005; Case Code (Imperial): 0402; Min Operating Temperature: -55°C; Max Operating Temperature: 125°C; Package Quantity: 10000; Packaging: Tape and Reel; Composition: Thin Film; Number of Terminations: 2; Termination: SMD/SMT; Military Standard: Not; Voltage Rating (DC): 50V; Features: Moisture Resistant; Length: 1mm; Height: 0.014inch; Width: 0.02inch; Depth: 0.5mm; Lead Free: Lead Free; ComponentLink1URL: https://datasheet.ciiva.com/2582/pyu-rt-1-to-0-05-rohs-l-5-2582672.pdf?src-supplier=Digi-Key; ComponentLink1Description: https://datasheet.ciiva.com/2582/pyu-rt-1-to-0-05-rohs-l-5-2582672.pdf?src-supplier=Digi-Key; ComponentLink2URL: https://datasheet.ciiva.com/12796/pyu-rt-1-to-0-05-rohs-l-4-12796476.pdf?src-supplier=Mouser; ComponentLink2Description: https://datasheet.ciiva.com/12796/pyu-rt-1-to-0-05-rohs-l-4-12796476.pdf?src-supplier=Mouser; Supplier Part Number 1: YAG2306CT-ND
U8 = IC ADC 24 BIT AUDIO 216KHZ SSOP-28: ADC, Audio 24 bit 216k DSP, PCM 28-SSOP; Manufacturer: Texas Instruments; Operating Supply Voltage: 5V; Interface: Serial; Number of Bits: 24; Sampling Rate: 216KS/s; Number of A/D Converters: 2; Max Power Dissipation: 408mW; Max Supply Voltage: 5.25V; Min Supply Voltage: 4.75V; Nominal Supply Current: 55mA; Power Consumption: 338mW; Resolution: 24b; Polarity: Bipolar; Number of Analog Inputs: 1; Supply Type: Analog; Number of DAC Channels: 0; Supplier 1: Digi-Key; Supplier Part Number 1: 296-17438-1-ND; Stock 1: 5943; Pricing 1: 1 = 9.85000, 10 = 8.89800, 100 = 7.36660 (USD); RoHS: Yes; Mount: Surface Mount; Case/Package: SSOP; Number of Pins: 28; Weight: 0.008529oz; Min Operating Temperature: -10°C; Max Operating Temperature: 70°C; Package Quantity: 250; Packaging: Tape and Reel; Number of Converters: 2; Number of Elements: 2; Power Dissipation: 408mW; Conversion Rate: 216KS/s; Number of ADC Channels: 2; Length: 10.2mm; Height: 1.95mm; Width: 5.3mm; Radiation Hardening: No; Lead Free: Lead Free; REACH SVHC: No SVHC; ComponentLink1URL: https://datasheet.ciiva.com/25988/sbas290b-25988737.pdf?src-supplier=Avnet+Europe; ComponentLink1Description: https://datasheet.ciiva.com/25988/sbas290b-25988737.pdf?src-supplier=Avnet+Europe; ComponentLink2URL: https://datasheet.ciiva.com/41460/001186374-da-01-en-ic-adc-stereo-24b-pcm4202dbt-ssop-28-tid-41460403.pdf?src-supplier=Conrad; ComponentLink2Description: https://datasheet.ciiva.com/41460/001186374-da-01-en-ic-adc-stereo-24b-pcm4202dbt-ssop-28-tid-41460403.pdf?src-supplier=Conrad; ComponentLink3URL: https://datasheet.ciiva.com/26800/pcm4202dbt-26800794.pdf?src-supplier=IIIC; ComponentLink3Description: https://datasheet.ciiva.com/26800/pcm4202dbt-26800794.pdf?src-supplier=IIIC; ComponentLink4URL: https://datasheet.ciiva.com/29896/sbas290b-29896124.pdf?src-supplier=Avnet; ComponentLink4Description: https://datasheet.ciiva.com/29896/sbas290b-29896124.pdf?src-supplier=Avnet; ComponentLink5URL: https://datasheet.ciiva.com/1307/pcm4202-1307121.pdf?src-supplier=Digi-Key; ComponentLink5Description: https://datasheet.ciiva.com/1307/pcm4202-1307121.pdf?src-supplier=Digi-Key; ComponentLink6URL: https://datasheet.ciiva.com/1307/pcm4202-1307122.pdf?src-supplier=Digi-Key; ComponentLink6Description: https://datasheet.ciiva.com/1307/pcm4202-1307122.pdf?src-supplier=Digi-Key; ComponentLink7URL: https://datasheet.ciiva.com/1307/pcm4202-1307123.pdf?src-supplier=Digi-Key; ComponentLink7Description: https://datasheet.ciiva.com/1307/pcm4202-1307123.pdf?src-supplier=Digi-Key; ComponentLink8URL: https://datasheet.ciiva.com/15147/getdatasheetpartid-171631-15147899.pdf?src-supplier=Verical; ComponentLink8Description: https://datasheet.ciiva.com/15147/getdatasheetpartid-171631-15147899.pdf?src-supplier=Verical
U11 = IC OP AMP AUDIO LME49724 8-SOIC: Audio Amplifier 1 Circuit Differential 8-SO PowerPad; Manufacturer: TI National Semiconductor; Max Supply Voltage: 36V; Min Supply Voltage: 5V; Voltage Gain: 125dB; Unity Gain Bandwidth Product: 50MHz; Slew Rate: 18V/µs; Common Mode Rejection Ratio: 95dB; Min Dual Supply Voltage: 2.5V; Max Dual Supply Voltage: 18V; Output Current: 80mA; Number of Circuits: 1; Input Bias Current: 60nA; Input Offset Voltage (Vos): 200uV; Operating Supply Current: 10mA; Supplier 1: Digi-Key; Supplier Part Number 1: 296-37390-1-ND; Stock 1: 17947; Pricing 1: 1 = 2.67000, 10 = 2.40200, 100 = 1.93060, 500 = 1.58620, 1000 = 1.31428 (USD); RoHS: Yes; Mount: Surface Mount; Number of Pins: 8; Contact Plating: Tin; Min Operating Temperature: -40°C; Max Operating Temperature: 85°C; Packaging: Tape and Reel; Package Quantity: 2500; Gain Bandwidth Product: 50MHz; Output Current per Channel: 80mA; Number of Channels: 1; Number of Elements: 1; Power Supply Rejection Ratio (PSRR): 95dB; Radiation Hardening: No; Lead Free: Lead Free; ComponentLink1URL: https://datasheet.ciiva.com/29638/lme49724-29638149.pdf?src-supplier=Digi-Key; ComponentLink1Description: https://datasheet.ciiva.com/29638/lme49724-29638149.pdf?src-supplier=Digi-Key; ComponentLink2URL: https://datasheet.ciiva.com/29638/lme49724-29638731.pdf?src-supplier=Digi-Key; ComponentLink2Description: https://datasheet.ciiva.com/29638/lme49724-29638731.pdf?src-supplier=Digi-Key; ComponentLink3URL: https://datasheet.ciiva.com/1818/lme49724-1818445.pdf?src-supplier=Digi-Key; ComponentLink3Description: https://datasheet.ciiva.com/1818/lme49724-1818445.pdf?src-supplier=Digi-Key
U12 = IC OP AMP GEN PURPOSE RR 5.5MHZ SOT-23-5: General Purpose Amplifier 1 Circuit Rail-to-Rail SOT-23-5; Manufacturer: Texas Instruments; Max Supply Voltage: 5.5V; Min Supply Voltage: 2.2V; Output Current: 30mA; Nominal Supply Current: 950uA; Voltage Gain: 134dB; Common Mode Rejection Ratio: 76dB; Number of Channels: 1; Slew Rate: 2V/µs; Max I/O Voltage: 25uV; Input Bias Current: 10pA; Operating Supply Current: 760uA; Output Current per Channel: 50mA; Power Supply Rejection Ratio (PSRR): 106.02dB; Supplier 1: Digi-Key; Stock 1: 26635; Pricing 1: 1 = 2.14000, 10 = 1.92200, 100 = 1.54450, 500 = 1.26896, 1000 = 1.05142 (USD); RoHS: Yes; Case/Package: SOT-23-5; Number of Pins: 5; Min Operating Temperature: -40°C; Max Operating Temperature: 125°C; Unity Gain Bandwidth Product: 5.5MHz; Packaging: Tape and Reel; Package Quantity: 3000; Number of Circuits: 1; Gain Bandwidth Product: 5.5MHz; Input Offset Voltage (Vos): 25uV; Number of Elements: 1; Radiation Hardening: No; Lead Free: Lead Free; ComponentLink1URL: http://www.ti.com/lit/ds/sbos549/sbos549.pdf?src-supplier=Avnet; ComponentLink1Description: http://www.ti.com/lit/ds/sbos549/sbos549.pdf?src-supplier=Avnet; Supplier Part Number 1: 296-36701-1-ND